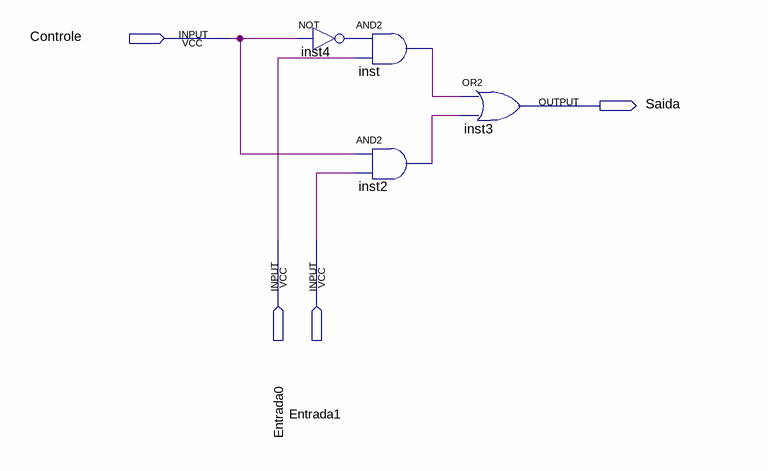
[diagram p0: schematic sheet]
// Quartus schematic Mux.bdf as structural Verilog: 4 symbols, 4 pins
module Mux (
  input  Controle,
  input  Entrada0,
  input  Entrada1,
  output Saida
);

  wire inst2_out, inst4_out, inst_out;

  and inst (inst_out, inst4_out, Entrada0);
  not inst4 (inst4_out, Controle);
  and inst2 (inst2_out, Controle, Entrada1);
  or inst3 (Saida, inst_out, inst2_out);
endmodule
